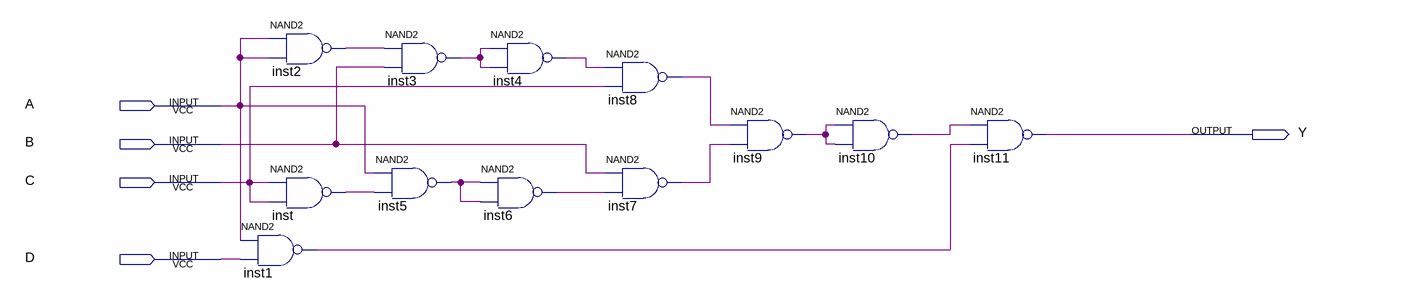
[diagram p0: schematic sheet]
// Quartus schematic schemat.bdf as structural Verilog: 12 symbols, 5 pins
module schemat (
  input  A,
  input  B,
  input  C,
  input  D,
  output Y
);

  wire inst1_out, inst2_out, inst3_out, inst4_out, inst5_out, inst6_out, inst7_out, inst8_out, inst9_out,
       inst10_out, inst_out;

  nand inst1 (inst1_out, A, D);
  nand inst2 (inst2_out, A, A);
  nand inst (inst_out, C, C);
  nand inst3 (inst3_out, inst2_out, B);
  nand inst5 (inst5_out, A, inst_out);
  nand inst6 (inst6_out, inst5_out, inst5_out);
  nand inst4 (inst4_out, inst3_out, inst3_out);
  nand inst8 (inst8_out, inst4_out, C);
  nand inst7 (inst7_out, B, inst6_out);
  nand inst9 (inst9_out, inst8_out, inst7_out);
  nand inst10 (inst10_out, inst9_out, inst9_out);
  nand inst11 (Y, inst10_out, inst1_out);
endmodule
